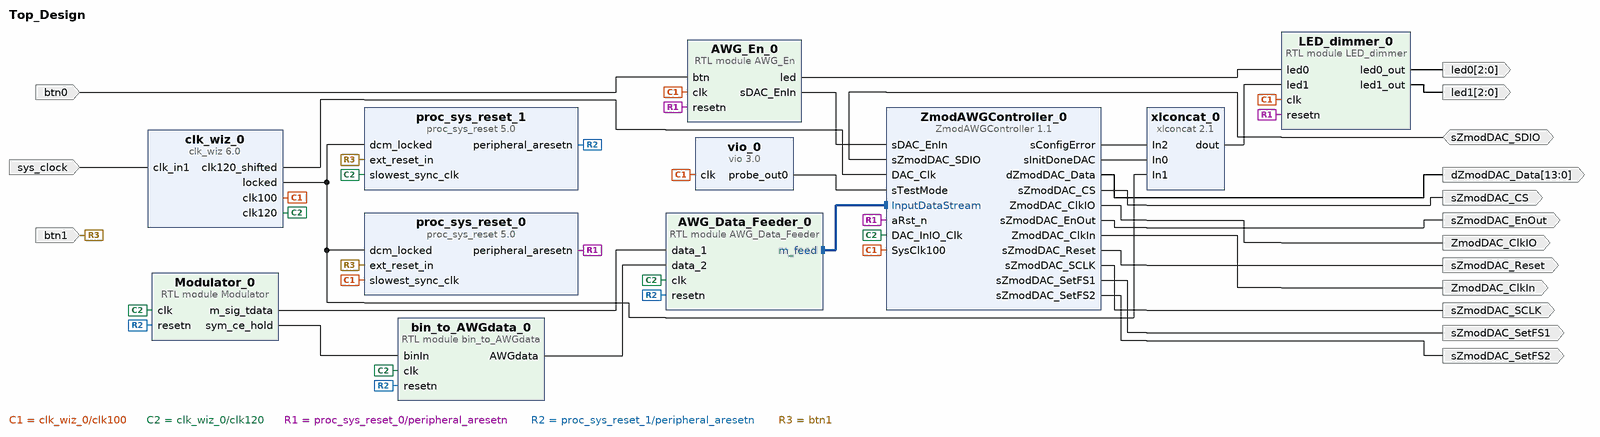
[diagram p0: block diagram of the top level]
# Vivado block design Top_Design, xc7z020clg484-1, Vivado 2021.2
create_bd_design Top_Design

create_bd_port -dir O sZmodDAC_CS
create_bd_port -dir O sZmodDAC_SCLK
create_bd_port -dir IO sZmodDAC_SDIO
create_bd_port -dir O -type rst sZmodDAC_Reset
create_bd_port -dir O -type clk ZmodDAC_ClkIO
create_bd_port -dir O -type clk ZmodDAC_ClkIn
create_bd_port -dir O -from 13 -to 0 dZmodDAC_Data
create_bd_port -dir O sZmodDAC_SetFS1
create_bd_port -dir O sZmodDAC_SetFS2
create_bd_port -dir O sZmodDAC_EnOut
create_bd_port -dir O -from 2 -to 0 led0
create_bd_port -dir I btn0
create_bd_port -dir O -from 2 -to 0 led1
create_bd_port -dir I -type clk sys_clock
set_property -dict {CONFIG.FREQ_HZ 125000000 CONFIG.PHASE 0.0} [get_bd_ports sys_clock]
create_bd_port -dir I -type rst btn1
set_property -dict {CONFIG.POLARITY ACTIVE_HIGH} [get_bd_ports btn1]

create_bd_cell -type ip -vlnv digilent.com:user:ZmodAWGController:1.1 ZmodAWGController_0
create_bd_cell -type ip -vlnv xilinx.com:ip:clk_wiz:6.0 clk_wiz_0
set_property -dict [list \
  CONFIG.CLKOUT1_JITTER 315.363 \
  CONFIG.CLKOUT1_PHASE_ERROR 335.459 \
  CONFIG.CLKOUT2_JITTER 304.177 \
  CONFIG.CLKOUT2_PHASE_ERROR 335.459 \
  CONFIG.CLKOUT2_REQUESTED_OUT_FREQ 120 \
  CONFIG.CLKOUT2_USED true \
  CONFIG.CLKOUT3_JITTER 304.177 \
  CONFIG.CLKOUT3_PHASE_ERROR 335.459 \
  CONFIG.CLKOUT3_REQUESTED_OUT_FREQ 120 \
  CONFIG.CLKOUT3_REQUESTED_PHASE 90 \
  CONFIG.CLKOUT3_USED true \
  CONFIG.CLK_IN1_BOARD_INTERFACE sys_clock \
  CONFIG.CLK_OUT1_PORT clk100 \
  CONFIG.CLK_OUT2_PORT clk120 \
  CONFIG.CLK_OUT3_PORT clk120_shifted \
  CONFIG.MMCM_CLKFBOUT_MULT_F 24.000 \
  CONFIG.MMCM_CLKIN1_PERIOD 8.0 \
  CONFIG.MMCM_CLKIN2_PERIOD 10.0 \
  CONFIG.MMCM_CLKOUT0_DIVIDE_F 6.000 \
  CONFIG.MMCM_CLKOUT1_DIVIDE 5 \
  CONFIG.MMCM_CLKOUT2_DIVIDE 5 \
  CONFIG.MMCM_CLKOUT2_PHASE 90.000 \
  CONFIG.NUM_OUT_CLKS 3 \
  CONFIG.USE_BOARD_FLOW true \
  CONFIG.USE_RESET false \
] [get_bd_cells clk_wiz_0]
create_bd_cell -type ip -vlnv xilinx.com:ip:proc_sys_reset:5.0 proc_sys_reset_0
create_bd_cell -type ip -vlnv xilinx.com:ip:vio:3.0 vio_0
set_property -dict {CONFIG.C_NUM_PROBE_IN 0} [get_bd_cells vio_0]
create_bd_cell -type ip -vlnv xilinx.com:ip:proc_sys_reset:5.0 proc_sys_reset_1
create_bd_cell -type ip -vlnv xilinx.com:ip:xlconcat:2.1 xlconcat_0
set_property -dict {CONFIG.IN0_WIDTH 1 CONFIG.IN1_WIDTH 1 CONFIG.IN2_WIDTH 1 CONFIG.NUM_PORTS 3} [get_bd_cells xlconcat_0]
create_bd_cell -type module -reference bin_to_AWGdata bin_to_AWGdata_0
create_bd_cell -type module -reference AWG_Data_Feeder AWG_Data_Feeder_0
create_bd_cell -type module -reference LED_dimmer LED_dimmer_0
create_bd_cell -type module -reference AWG_En AWG_En_0
create_bd_cell -type module -reference Modulator Modulator_0

# ---- connections ----

connect_bd_intf_net [get_bd_intf_pins AWG_Data_Feeder_0/m_feed] [get_bd_intf_pins ZmodAWGController_0/InputDataStream]
connect_bd_net [get_bd_pins AWG_En_0/led] [get_bd_pins LED_dimmer_0/led0]
connect_bd_net [get_bd_pins AWG_En_0/sDAC_EnIn] [get_bd_pins ZmodAWGController_0/sDAC_EnIn]
connect_bd_net [get_bd_pins LED_dimmer_0/led0_out] [get_bd_ports led0]
connect_bd_net [get_bd_pins LED_dimmer_0/led1_out] [get_bd_ports led1]
connect_bd_net [get_bd_pins Modulator_0/m_sig_tdata] [get_bd_pins AWG_Data_Feeder_0/data_1]
connect_bd_net [get_bd_pins Modulator_0/sym_ce_hold] [get_bd_pins bin_to_AWGdata_0/binIn]
connect_bd_net [get_bd_ports sZmodDAC_SDIO] [get_bd_pins ZmodAWGController_0/sZmodDAC_SDIO]
connect_bd_net [get_bd_pins ZmodAWGController_0/ZmodDAC_ClkIO] [get_bd_ports ZmodDAC_ClkIO]
connect_bd_net [get_bd_pins ZmodAWGController_0/ZmodDAC_ClkIn] [get_bd_ports ZmodDAC_ClkIn]
connect_bd_net [get_bd_pins ZmodAWGController_0/dZmodDAC_Data] [get_bd_ports dZmodDAC_Data]
connect_bd_net [get_bd_pins ZmodAWGController_0/sConfigError] [get_bd_pins xlconcat_0/In2]
connect_bd_net [get_bd_pins ZmodAWGController_0/sInitDoneDAC] [get_bd_pins xlconcat_0/In0]
connect_bd_net [get_bd_pins ZmodAWGController_0/sZmodDAC_CS] [get_bd_ports sZmodDAC_CS]
connect_bd_net [get_bd_pins ZmodAWGController_0/sZmodDAC_EnOut] [get_bd_ports sZmodDAC_EnOut]
connect_bd_net [get_bd_pins ZmodAWGController_0/sZmodDAC_Reset] [get_bd_ports sZmodDAC_Reset]
connect_bd_net [get_bd_pins ZmodAWGController_0/sZmodDAC_SCLK] [get_bd_ports sZmodDAC_SCLK]
connect_bd_net [get_bd_pins ZmodAWGController_0/sZmodDAC_SetFS1] [get_bd_ports sZmodDAC_SetFS1]
connect_bd_net [get_bd_pins ZmodAWGController_0/sZmodDAC_SetFS2] [get_bd_ports sZmodDAC_SetFS2]
connect_bd_net [get_bd_pins bin_to_AWGdata_0/AWGdata] [get_bd_pins AWG_Data_Feeder_0/data_2]
connect_bd_net -net btn0_1 [get_bd_ports btn0] [get_bd_pins AWG_En_0/btn]
connect_bd_net [get_bd_pins clk_wiz_0/clk100] \
  [get_bd_pins ZmodAWGController_0/SysClk100] [get_bd_pins proc_sys_reset_0/slowest_sync_clk] [get_bd_pins vio_0/clk] \
  [get_bd_pins AWG_En_0/clk] [get_bd_pins LED_dimmer_0/clk]
connect_bd_net [get_bd_pins clk_wiz_0/clk120] \
  [get_bd_pins ZmodAWGController_0/DAC_InIO_Clk] [get_bd_pins proc_sys_reset_1/slowest_sync_clk] \
  [get_bd_pins AWG_Data_Feeder_0/clk] [get_bd_pins bin_to_AWGdata_0/clk] [get_bd_pins Modulator_0/clk]
connect_bd_net [get_bd_pins clk_wiz_0/clk120_shifted] [get_bd_pins ZmodAWGController_0/DAC_Clk]
connect_bd_net [get_bd_pins clk_wiz_0/locked] \
  [get_bd_pins proc_sys_reset_0/dcm_locked] [get_bd_pins proc_sys_reset_1/dcm_locked] [get_bd_pins xlconcat_0/In1]
connect_bd_net [get_bd_pins proc_sys_reset_0/peripheral_aresetn] \
  [get_bd_pins ZmodAWGController_0/aRst_n] [get_bd_pins AWG_En_0/resetn] [get_bd_pins LED_dimmer_0/resetn]
connect_bd_net [get_bd_pins proc_sys_reset_1/peripheral_aresetn] \
  [get_bd_pins AWG_Data_Feeder_0/resetn] [get_bd_pins bin_to_AWGdata_0/resetn] [get_bd_pins Modulator_0/resetn]
connect_bd_net -net reset_rtl_1 [get_bd_ports btn1] [get_bd_pins proc_sys_reset_1/ext_reset_in] [get_bd_pins proc_sys_reset_0/ext_reset_in]
connect_bd_net [get_bd_ports sys_clock] [get_bd_pins clk_wiz_0/clk_in1]
connect_bd_net [get_bd_pins vio_0/probe_out0] [get_bd_pins ZmodAWGController_0/sTestMode]
connect_bd_net [get_bd_pins xlconcat_0/dout] [get_bd_pins LED_dimmer_0/led1]

validate_bd_design
save_bd_design
